# Altium project bms_mainboard-1_1.PrjPcb (part 8 of 8)

## Sheet pmic_bq25690_battcharger.SchDoc
size B
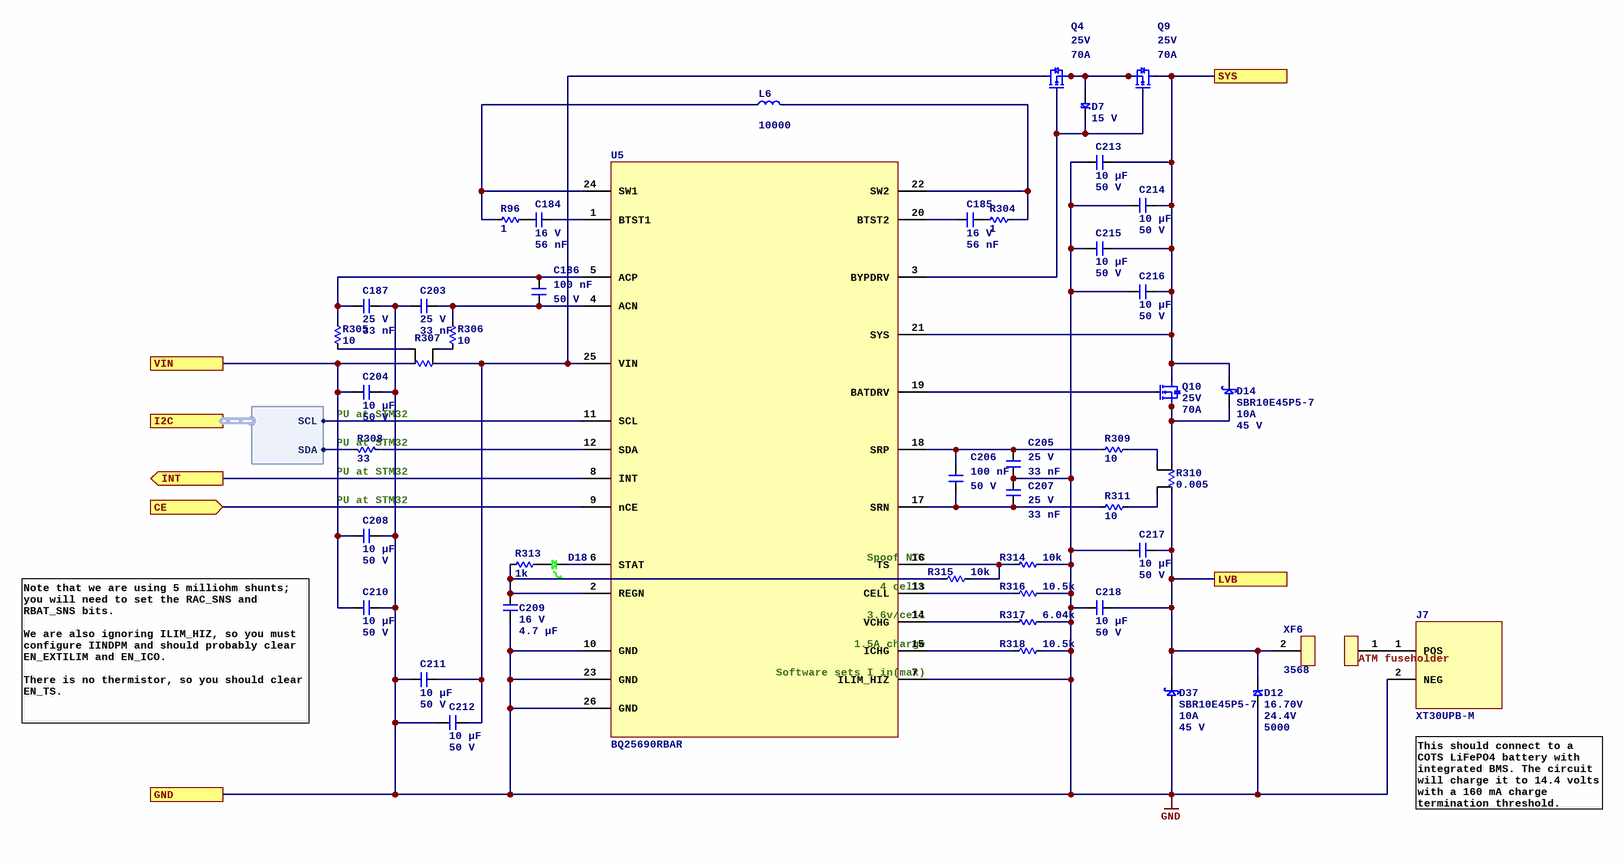
[diagram p46: pmic_bq25690_battcharger.SchDoc]

### Parts
C184  Voltage Rating: 16 V  Capacitance: 56 nF  [C0402]  (hidden comment: CC0402KRX7R7BB563)
C185  Voltage Rating: 16 V  Capacitance: 56 nF  [C0402]  (hidden comment: CC0402KRX7R7BB563)
C186  Capacitance: 100 nF  Voltage Rating: 50 V  [C0402]  (hidden comment: CL05B104KB54PNC)
C187  Voltage Rating: 25 V  Capacitance: 33 nF  [C0402]  (hidden comment: 0402B333K250NT)
C203  Voltage Rating: 25 V  Capacitance: 33 nF  [C0402]  (hidden comment: 0402B333K250NT)
C204  Capacitance: 10 µF  Voltage Rating: 50 V  [C1206]  (hidden comment: CL31B106KBHNNNE)
C205  Voltage Rating: 25 V  Capacitance: 33 nF  [C0402]  (hidden comment: 0402B333K250NT)
C206  Capacitance: 100 nF  Voltage Rating: 50 V  [C0402]  (hidden comment: CL05B104KB54PNC)
C207  Voltage Rating: 25 V  Capacitance: 33 nF  [C0402]  (hidden comment: 0402B333K250NT)
C208  Capacitance: 10 µF  Voltage Rating: 50 V  [C1206]  (hidden comment: CL31B106KBHNNNE)
C209  Voltage Rating: 16 V  Capacitance: 4.7 µF  [C0603]  (hidden comment: GRM188Z71C475KE21D)
C210  Capacitance: 10 µF  Voltage Rating: 50 V  [C1206]  (hidden comment: CL31B106KBHNNNE)
C211  Capacitance: 10 µF  Voltage Rating: 50 V  [C1206]  (hidden comment: CL31B106KBHNNNE)
C212  Capacitance: 10 µF  Voltage Rating: 50 V  [C1206]  (hidden comment: CL31B106KBHNNNE)
C213  Capacitance: 10 µF  Voltage Rating: 50 V  [C1206]  (hidden comment: CL31B106KBHNNNE)
C214  Capacitance: 10 µF  Voltage Rating: 50 V  [C1206]  (hidden comment: CL31B106KBHNNNE)
C215  Capacitance: 10 µF  Voltage Rating: 50 V  [C1206]  (hidden comment: CL31B106KBHNNNE)
C216  Capacitance: 10 µF  Voltage Rating: 50 V  [C1206]  (hidden comment: CL31B106KBHNNNE)
C217  Capacitance: 10 µF  Voltage Rating: 50 V  [C1206]  (hidden comment: CL31B106KBHNNNE)
C218  Capacitance: 10 µF  Voltage Rating: 50 V  [C1206]  (hidden comment: CL31B106KBHNNNE)
D7  Vr: 15 V  [SOD323]  (hidden comment: MM3Z15VC)
D12  Min Breakdown Voltage: 16.70V  Clamping Voltage-Max: 24.4V  Power (W): 5000  [SMC]  (hidden comment: 5.0SMDJ15A)
D14  SBR10E45P5-7  Current: 10A  Vr: 45 V  [POWERDI5]
D18  LTST-C190GKT  [LED_0603P_GREEN]  (value not drawn)
D37  SBR10E45P5-7  Current: 10A  Vr: 45 V  [POWERDI5]
J7  XT30UPB-M  [AMASS_XT30UPB-M]
L6  Current Rating (mA): 10000  [BOURNS_SRP1265A]  (hidden comment: SRP1265A-100M)
Q4  Voltage: 25V  Current: 70A  [SOT1210]  (hidden comment: PSMN2R0-25MLDX)
Q9  Voltage: 25V  Current: 70A  [SOT1210]  (hidden comment: PSMN2R0-25MLDX)
Q10  Voltage: 25V  Current: 70A  [SOT1210]  (hidden comment: PSMN2R0-25MLDX)
R96  value 1  [R0402]  (hidden comment: CRCW04021R00FKED)
R304  value 1  [R0402]  (hidden comment: CRCW04021R00FKED)
R305  value 10  [R0402]  (hidden comment: FRC0402F10R0TS)
R306  value 10  [R0402]  (hidden comment: FRC0402F10R0TS)
R307  WSL27265L000FEB  [VISHAY_WSL2726]  (value not drawn)
R308  value 33  [R0402]  (hidden comment: 0402WGF330JTCE)
R309  value 10  [R0402]  (hidden comment: FRC0402F10R0TS)
R310  value 0.005  [VISHAY_WSL2726]  (hidden comment: WSL27265L000FEB)
R311  value 10  [R0402]  (hidden comment: FRC0402F10R0TS)
R313  value 1k  [R0402]  (hidden comment: 0402WGF1001TCE)
R314  value 10k  [R0402]  (hidden comment: 0402WGF1002TCE)
R315  value 10k  [R0402]  (hidden comment: 0402WGF1002TCE)
R316  value 10.5k  [R0402]  (hidden comment: 0402WGF1052TCE)
R317  value 6.04k  [R0402]  (hidden comment: 0402WGF6041TCE)
R318  value 10.5k  [R0402]  (hidden comment: 0402WGF1052TCE)
U5  BQ25690RBAR  [TI_RBA]
XF6  3568  [FUSEHOLDER_KEYSTONE_3568]

### Ports
CE (in), GND, I2C (harness I2C), INT (out), LVB, SYS, VIN

### Harnesses
I2C: SCL, SDA

### Nets
15P0: C204.1 C208.1 C210.1 R307.2 ; port VIN
GND: C187.2 C203.1 C204.2 C205.1 C207.2 C208.2 C209.1 C210.2 C211.2 C212.2 C213.2 C214.2 C215.2 C216.2 C217.2 C218.2 D12.1 D37.1 J7.2(NEG) R314.1 R316.1 R317.1 R318.1 U5.7(ILIM_HIZ) U5.10(GND) U5.23(GND) U5.26(GND) ; port GND
LVB: C217.1 C218.1 D12.2 D37.2 R310.2 XF6.2 ; port LVB
SYS: C213.1 C214.1 C215.1 C216.1 D14.2 Q9.5 Q10.5 U5.21(SYS) ; port SYS
BQ25690_INT: U5.8(INT) ; port INT
BQ25690_nCE: U5.9(nCE) ; port CE
I2C1.SCL: U5.11(SCL) ; port I2C.SCL
I2C1.SDA: R308.1 ; port I2C.SDA
NetC184_1: C184.1 R96.2
NetC184_2: C184.2 U5.1(BTST1)
NetC185_1: C185.1 U5.20(BTST2)
NetC185_2: C185.2 R304.1
NetC186_1: C186.1 C187.1 R305.2 U5.5(ACP)
NetC186_2: C186.2 C203.2 R306.2 U5.4(ACN)
NetC205_2: C205.2 C206.1 R309.2 U5.18(SRP)
NetC206_2: C206.2 C207.1 R311.2 U5.17(SRN)
NetC209_2: C209.2 R313.1 R315.2 U5.2(REGN)
NetC211_1: C211.1 C212.1 Q4.5 R307.1 U5.25(VIN)
NetD7_1: D7.1 Q4.1 Q4.2 Q4.3 Q9.1 Q9.2 Q9.3
NetD7_2: D7.2 Q4.4 Q9.4 U5.3(BYPDRV)
NetD14_1: D14.1 Q10.1 Q10.2 Q10.3 R310.1
NetD18_1: D18.1 R313.2
NetD18_2: D18.2 U5.6(STAT)
NetJ7_1: J7.1(POS) XF6.1
NetL6_1: L6.1 R96.1 U5.24(SW1)
NetL6_2: L6.2 R304.2 U5.22(SW2)
NetQ10_4: Q10.4 U5.19(BATDRV)
NetR305_1: R305.1 R307.4
NetR306_1: R306.1 R307.3
NetR308_2: R308.2 U5.12(SDA)
NetR309_1: R309.1 R310.3
NetR310_4: R310.4 R311.1
NetR314_2: R314.2 R315.1 U5.16(TS)
NetR316_2: R316.2 U5.13(CELL)
NetR317_2: R317.2 U5.14(VCHG)
NetR318_2: R318.2 U5.15(ICHG)

### Notes on the sheet
- PU at STM32
- (near R308) PU at STM32
- (near R315) 4 cells
- (near R315) Spoof NTC
- 3.6v/cell
- 1.5A charge
- Software sets I_in(max)
- Note that we are using 5 milliohm shunts; you will need to set the RAC_SNS and RBAT_SNS bits.
  We are also ignoring ILIM_HIZ, so you must configure IINDPM and should probably clear EN_EXTILIM and EN_ICO.
  There is no thermistor, so you should clear EN_TS.
- This should connect to a COTS LiFePO4 battery with integrated BMS. The circuit will charge it to 14.4 volts with a 160 mA charge termination threshold.
- (in symbol 3568) ATM fuseholder

### Library data of the parts
C184 C185 = CC0402KRX7R7BB563: Manufacturer: YAGEO; Dielectric: X7R; Manufacturer Part Number: CC0402KRX7R7BB563; Package: 0402; Supplier 2: LCSC; Supplier Part Number 2: C107018; ComponentLink1Description: Datasheet; ComponentLink1URL: https://wmsc.lcsc.com/wmsc/upload/file/pdf/v2/lcsc/2304140030_YAGEO-CC0402KRX7R7BB563_C107018.pdf
C186 C206 = CL05B104KB54PNC: Manufacturer: Samsung Electro-Mechanics; Dielectric: X7R; ComponentLink1URL: https://wmsc.lcsc.com/wmsc/upload/file/pdf/v2/lcsc/2304140030_Samsung-Electro-Mechanics-CL05B104KB54PNC_C307331.pdf; ComponentLink1Description: Datasheet; Manufacturer Part Number: CL05B104KB54PNC; Package: 0402; Supplier 2: LCSC; Supplier Part Number 2: C307331
C187 C203 C205 C207 = 0402B333K250NT: Manufacturer: FH (Guangdong Fenghua Advanced Tech); Dielectric: X7R; Manufacturer Part Number: 0402B333K250NT; Package: 0402; Supplier 2: LCSC; Supplier Part Number 2: C285174; ComponentLink1Description: Datasheet; ComponentLink1URL: https://datasheet.lcsc.com/lcsc/2110191430_FH--Guangdong-Fenghua-Advanced-Tech-0402B333K250NT_C285174.pdf
C204 C208 C210-C218 = CL31B106KBHNNNE: Manufacturer: Samsung Electro-Mechanics; Dielectric: X7R; ComponentLink1URL: https://wmsc.lcsc.com/wmsc/upload/file/pdf/v2/lcsc/1810221111_Samsung-Electro-Mechanics-CL31B106KBHNNNE_C89632.pdf; ComponentLink1Description: Datasheet; Manufacturer Part Number: CL31B106KBHNNNE; Package: 1206; Supplier 2: LCSC; Supplier Part Number 2: C89632
C209 = GRM188Z71C475KE21D: Manufacturer: Murata Electronics; Dielectric: X7R; Manufacturer Part Number: GRM188Z71C475KE21D; Package: 0603; Supplier 2: LCSC; Supplier Part Number 2: C389010; ComponentLink1Description: Datasheet; ComponentLink1URL: https://wmsc.lcsc.com/wmsc/upload/file/pdf/v2/lcsc/1912111437_Murata-Electronics-GRM188Z71C475KE21D_C389010.pdf
D7 = MM3Z15VC: DIODE ZENER 15V 200MW SOD; Manufacturer: onsemi; Current: 13.3 mA; Supplier 1: DigiKey; Manufacturer Part Number: MM3Z15VC; ComponentLink1URL: https://www.onsemi.com/pdf/datasheet/mm3z9v1c-d.pdf; ComponentLink1Description: Datasheet; Supplier Part Number 1: MM3Z15VCCT-ND; Supplier 2: LCSC; Supplier Part Number 2: C891582; Diode Type: Zener; Supplier 3: Mouser; Supplier Part Number 3: 512-MM3Z15VC
D12 = 5.0SMDJ15A: TVS DIODE 15VWM 24.4VC DO214AB; Manufacturer: Bourns Inc.; Polarity: Unidirectional; Standoff (V): 15; ComponentLink1URL: https://www.bourns.com/docs/product-datasheets/5-0smdj.pdf; ComponentLink1Description: Datasheet; Supplier 1: DigiKey; Supplier Part Number 1: 5.0SMDJ15ABBCT-ND; Manufacturer Part Number: 5.0SMDJ15A; Supplier 2: LCSC; Supplier Part Number 2: C3707853; Supplier 3: Mouser; Supplier Part Number 3: 652-5.0SMDJ15A
D14 D37 = SBR10E45P5-7: Rectifier Diode, 1 Phase, 1 Element, 10A, 45V V(RRM), Silicon; Manufacturer: Diodes; Diode Type: Schottky; Supplier 1: DigiKey; Supplier Part Number 1: SBR10E45P5-7DICT-ND; Manufacturer Part Number: SBR10E45P5-7; ComponentLink1Description: Datasheet; ComponentLink1URL: https://www.diodes.com/assets/Datasheets/SBR10E45P5.pdf; Supplier 2: LCSC; Supplier Part Number 2: C73569; Supplier 3: Mouser; Supplier Part Number 3: 621-SBR10E45P5-7
D18 = LTST-C190GKT: LED GREEN CLEAR 0603 SMD; Manufacturer: Lite-On Inc; Vf: 2.0 V; If: 20 mA; Supplier 1: DigiKey; ComponentLink1URL: https://mm.digikey.com/Volume0/opasdata/d220001/medias/docus/858/LTST-C190GKT.pdf; ComponentLink1Description: Datasheet; Supplier Part Number 1: 160-1183-1-ND; Manufacturer Part Number: LTST-C190GKT; Supplier 2: LCSC; Supplier Part Number 2: C125093; LED Color: Green; Supplier 3: Mouser; Supplier Part Number 3: 859-LTST-C190GKT
J7 = XT30UPB-M: Vertical PCB mount XT30 male; Manufacturer: Changzhou Amass Elec; Manufacturer Part Number: XT30UPB-M; ComponentLink1Description: Datasheet; ComponentLink1URL: https://www.tme.com/Document/1191bc2fa3aee3c446e5a895fd8f7983/XT60PW-F.pdf; Supplier 2: LCSC; Supplier Part Number 2: C428721
L6 = SRP1265A-100M: 10 µH shielded power inductor; Manufacturer: BOURNS; DCR (mOhms): 16.5; Inductance (µH): 10; Manufacturer Part Number: SRP1265A-100M; Supplier 1: DigiKey; Supplier Part Number 1: SRP1265A-100MCT-ND; Supplier 2: LCSC; Supplier Part Number 2: C840531; ComponentLink1Description: Datasheet; ComponentLink1URL: https://www.bourns.com/docs/Product-Datasheets/SRP1265A.pdf; Supplier 3: Mouser; Supplier Part Number 3: 652-SRP1265A-100M
Q4 Q9 Q10 = PSMN2R0-25MLDX: N-Channel 25 V 70A (Tc) 74W (Tc) Surface Mount LFPAK33; Manufacturer: Nexperia; Supplier 1: DigiKey; Supplier Part Number 1: 1727-2501-1-ND; Manufacturer Part Number: PSMN2R0-25MLDX; Supplier 2: LCSC; Supplier Part Number 2: C553243; ComponentLink1Description: Datasheet; ComponentLink1URL: https://assets.nexperia.com/documents/data-sheet/PSMN2R0-25MLD.pdf; Channel Type: N-channel; Supplier 3: Mouser; Supplier Part Number 3: 771-PSMN2R0-25MLDX
R96 R304 = CRCW04021R00FKED: Manufacturer: Vishay Intertech; Power Rating (mW): 63; Tolerance: 1%; Temperature Coefficient: ±100ppm/?; Manufacturer Part Number: CRCW04021R00FKED; Package: 0402; Supplier 2: LCSC; Supplier Part Number 2: C482087; ComponentLink1Description: Datasheet; ComponentLink1URL: https://wmsc.lcsc.com/wmsc/upload/file/pdf/v2/lcsc/2211030200_Vishay-Intertech-CRCW04021R00FKED_C482087.pdf
R305 R306 R309 R311 = FRC0402F10R0TS: Manufacturer: FOJAN; Power Rating (mW): 62.5; Tolerance: 1%; Temperature Coefficient: ±100ppm/?; Manufacturer Part Number: FRC0402F10R0TS; Package: 0402; Supplier 2: LCSC; Supplier Part Number 2: C2906862; ComponentLink1Description: Datasheet; ComponentLink1URL: https://datasheet.lcsc.com/lcsc/2308241947_FOJAN-FRC0402F10R0TS_C2906862.pdf
R307 = WSL27265L000FEB: Manufacturer: Vishay Dale; Value: 0.005; Tolerance: 1%; Power Rating (mW): 3000; Supplier 1: DigiKey; Manufacturer Part Number: WSL27265L000FEB; ComponentLink1URL: http://www.vishay.com/docs/30131/wsl2726.pdf; ComponentLink1Description: Datasheet; Supplier Part Number 1: WSLQ-.005CT-ND; Supplier 2: LCSC; Supplier Part Number 2: C1517421; Package: 2726
R308 = 0402WGF330JTCE: as R149-R153 on sheet eth_10base-t1s_phy; ComponentLink1Description: Datasheet; ComponentLink1URL: https://wmsc.lcsc.com/wmsc/upload/file/pdf/v2/lcsc/2205311900_UNI-ROYAL-Uniroyal-Elec-0402WGF330JTCE_C25105.pdf; Manufacturer Part Number: 0402WGF330JTCE; Package: 0402; Supplier 2: LCSC; Supplier Part Number 2: C25105
R310 = WSL27265L000FEB: Manufacturer: Vishay Dale; Tolerance: 1%; Power Rating (mW): 3000; Supplier 1: DigiKey; Manufacturer Part Number: WSL27265L000FEB; ComponentLink1URL: http://www.vishay.com/docs/30131/wsl2726.pdf; ComponentLink1Description: Datasheet; Supplier Part Number 1: WSLQ-.005CT-ND; Supplier 2: LCSC; Supplier Part Number 2: C1517421; Package: 2726
R313 = 0402WGF1001TCE: Manufacturer: UNI-ROYAL(Uniroyal Elec); Tolerance: 1%; Temperature Coefficient: ±100ppm/?; Power Rating (mW): 62.5; ComponentLink1Description: Datasheet; ComponentLink1URL: https://wmsc.lcsc.com/wmsc/upload/file/pdf/v2/lcsc/2206010216_UNI-ROYAL-Uniroyal-Elec-0402WGF1001TCE_C11702.pdf; Manufacturer Part Number: 0402WGF1001TCE; Package: 0402; Supplier 2: LCSC; Supplier Part Number 2: C11702
R314 R315 = 0402WGF1002TCE: Manufacturer: UNI-ROYAL(Uniroyal Elec); Power Rating (mW): 62.5; Tolerance: 1%; Temperature Coefficient: ±100ppm/?; Manufacturer Part Number: 0402WGF1002TCE; Package: 0402; Supplier 2: LCSC; Supplier Part Number 2: C25744; ComponentLink1Description: Datasheet; ComponentLink1URL: https://wmsc.lcsc.com/wmsc/upload/file/pdf/v2/lcsc/2206010100_UNI-ROYAL-Uniroyal-Elec-0402WGF1002TCE_C25744.pdf
R316 R318 = 0402WGF1052TCE: Manufacturer: UNI-ROYAL(Uniroyal Elec); Power Rating (mW): 62.5; Tolerance: 1%; Temperature Coefficient: ±100ppm/?; Manufacturer Part Number: 0402WGF1052TCE; Package: 0402; Supplier 2: LCSC; Supplier Part Number 2: C25850; ComponentLink1Description: Datasheet; ComponentLink1URL: https://wmsc.lcsc.com/wmsc/upload/file/pdf/v2/lcsc/2206010045_UNI-ROYAL-Uniroyal-Elec-0402WGF1052TCE_C25850.pdf
R317 = 0402WGF6041TCE: Manufacturer: UNI-ROYAL(Uniroyal Elec); Power Rating (mW): 62.5; Tolerance: 1%; Temperature Coefficient: ±100ppm/?; Manufacturer Part Number: 0402WGF6041TCE; Package: 0402; Supplier 2: LCSC; Supplier Part Number 2: C25913; ComponentLink1Description: Datasheet; ComponentLink1URL: https://wmsc.lcsc.com/wmsc/upload/file/pdf/v2/lcsc/2206010045_UNI-ROYAL-Uniroyal-Elec-0402WGF6041TCE_C25913.pdf
U5 = BQ25690RBAR: Charger IC Lithium Ion/Polymer 26-WQFN-HR (4x3.5); Manufacturer: Texas Instruments; Supplier 1: DigiKey; Supplier Part Number 1: 296-BQ25690RBARCT-ND; Manufacturer Part Number: BQ25690RBAR; ComponentLink1Description: Datasheet; ComponentLink1URL: https://www.ti.com/lit/ds/symlink/bq25690.pdf; Supplier 2: LCSC; Supplier Part Number 2: C53283868; Supplier 3: Mouser; Supplier Part Number 3: 595-BQ25690RBAR
XF6 = 3568: Fuse Holder 30 A 500V 1 Circuit Blade Through Hole; Manufacturer: Keystone Electronics; Supplier 1: DigiKey; Supplier Part Number 1: 36-3568-ND; Manufacturer Part Number: 3568; ComponentLink1URL: https://www.keyelco.com/userAssets/file/M65p42.pdf; ComponentLink1Description: Datasheet; Supplier 2: LCSC; Supplier Part Number 2: C3206956; Supplier 3: Mouser; Supplier Part Number 3: 534-3568

## Sheet audio_tas5720_amplifier.SchDoc
size A
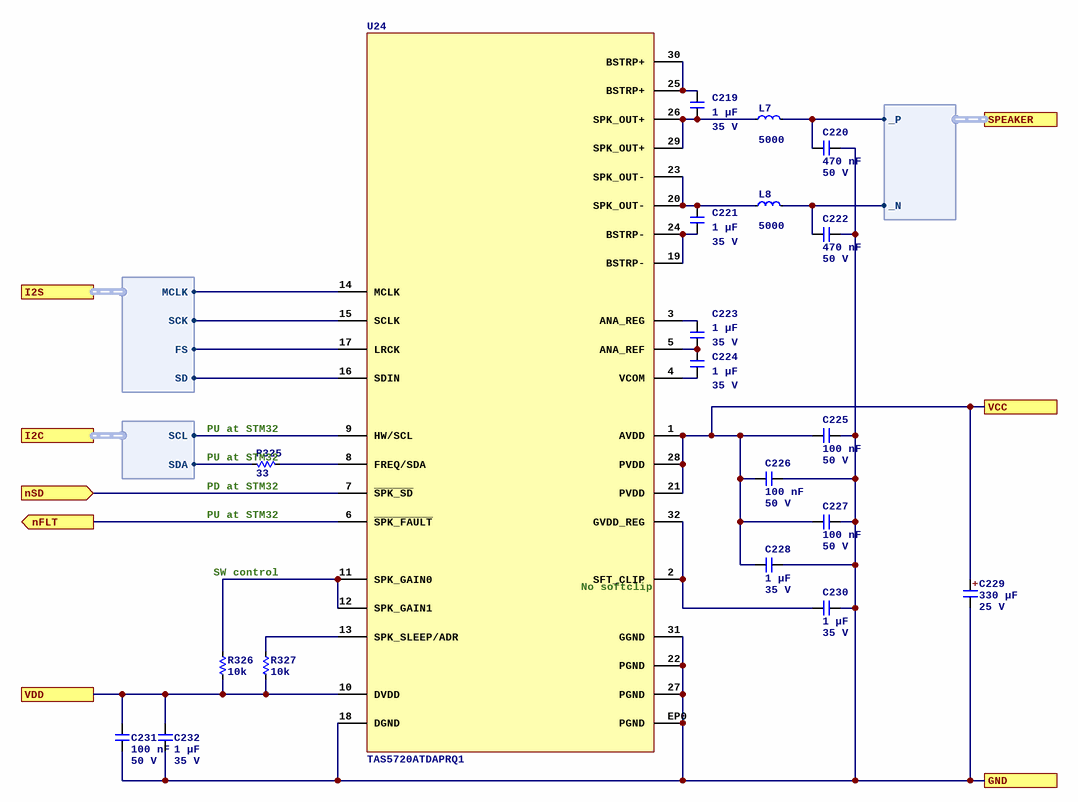
[diagram p47: audio_tas5720_amplifier.SchDoc]

### Parts
C219  Capacitance: 1 µF  Voltage Rating: 35 V  [C0603]  (hidden comment: GMK107AB7105KAHT)
C220  Capacitance: 470 nF  Voltage Rating: 50 V  [C0603]  (hidden comment: CC0603KRX7R9BB474)
C221  Capacitance: 1 µF  Voltage Rating: 35 V  [C0603]  (hidden comment: GMK107AB7105KAHT)
C222  Capacitance: 470 nF  Voltage Rating: 50 V  [C0603]  (hidden comment: CC0603KRX7R9BB474)
C223  Capacitance: 1 µF  Voltage Rating: 35 V  [C0603]  (hidden comment: GMK107AB7105KAHT)
C224  Capacitance: 1 µF  Voltage Rating: 35 V  [C0603]  (hidden comment: GMK107AB7105KAHT)
C225  Capacitance: 100 nF  Voltage Rating: 50 V  [C0402]  (hidden comment: CL05B104KB54PNC)
C226  Capacitance: 100 nF  Voltage Rating: 50 V  [C0402]  (hidden comment: CL05B104KB54PNC)
C227  Capacitance: 100 nF  Voltage Rating: 50 V  [C0402]  (hidden comment: CL05B104KB54PNC)
C228  Capacitance: 1 µF  Voltage Rating: 35 V  [C0603]  (hidden comment: GMK107AB7105KAHT)
C229  Capacitance: 330 µF  Voltage Rating: 25 V  [CAP_10001050_SMD]  (hidden comment: EEH-ZC1E331P)
C230  Capacitance: 1 µF  Voltage Rating: 35 V  [C0603]  (hidden comment: GMK107AB7105KAHT)
C231  Capacitance: 100 nF  Voltage Rating: 50 V  [C0402]  (hidden comment: CL05B104KB54PNC)
C232  Capacitance: 1 µF  Voltage Rating: 35 V  [C0603]  (hidden comment: GMK107AB7105KAHT)
L7  Current Rating (mA): 5000  [BOURNS_SRP5050FA]  (hidden comment: SRP5050FA-100M1)
L8  Current Rating (mA): 5000  [BOURNS_SRP5050FA]  (hidden comment: SRP5050FA-100M1)
R325  value 33  [R0402]  (hidden comment: 0402WGF330JTCE)
R326  value 10k  [R0402]  (hidden comment: 0402WGF1002TCE)
R327  value 10k  [R0402]  (hidden comment: 0402WGF1002TCE)
U24  TAS5720ATDAPRQ1  [TI_DAP0032B]

### Ports
GND, I2C (harness I2C), I2S (harness I2S), nFLT (out), nSD (in), SPEAKER (harness DIFF), VCC, VDD

### Harnesses
DIFF: _N, _P
I2S: MCLK, SCK, SD, FS
I2C: SCL, SDA

### Nets
3P3: C231.1 C232.1 R326.2 R327.2 U24.10(DVDD) ; port VDD
GND: C220.2 C222.2 C225.2 C226.2 C227.2 C228.2 C229.2 C230.2 C231.2 C232.2 U24.18(DGND) U24.22(PGND) U24.27(PGND) U24.31(GGND) U24.EP0(PGND) ; port GND
LV2: C225.1 C226.1 C227.1 C228.1 C229.1 U24.1(AVDD) U24.21(PVDD) U24.28(PVDD) ; port VCC
I2C1.SCL: U24.9(HW/SCL) ; port I2C.SCL
I2C1.SDA: R325.1 ; port I2C.SDA
SAI1_I2S.FS: U24.17(LRCK) ; port I2S.FS
SAI1_I2S.MCLK: U24.14(MCLK) ; port I2S.MCLK
SAI1_I2S.SCK: U24.15(SCLK) ; port I2S.SCK
SAI1_I2S.SD: U24.16(SDIN) ; port I2S.SD
SPEAKER._N: C222.1 L8.2 ; port SPEAKER._N
SPEAKER._P: C220.1 L7.2 ; port SPEAKER._P
SPK_nFLT: U24.6(~{SPK_FAULT}) ; port nFLT
SPK_nSD: U24.7(~{SPK_SD}) ; port nSD
NetC219_1: C219.1 U24.25(BSTRP+) U24.30(BSTRP+)
NetC219_2: C219.2 L7.1 U24.26(SPK_OUT+) U24.29(SPK_OUT+)
NetC221_1: C221.1 L8.1 U24.20(SPK_OUT-) U24.23(SPK_OUT-)
NetC221_2: C221.2 U24.19(BSTRP-) U24.24(BSTRP-)
NetC223_1: C223.1 U24.3(ANA_REG)
NetC223_2: C223.2 C224.1 U24.5(ANA_REF)
NetC224_2: C224.2 U24.4(VCOM)
NetC230_1: C230.1 U24.2(SFT_CLIP) U24.32(GVDD_REG)
NetR325_2: R325.2 U24.8(FREQ/SDA)
NetR326_1: R326.1 U24.11(SPK_GAIN0) U24.12(SPK_GAIN1)
NetR327_1: R327.1 U24.13(SPK_SLEEP/ADR)

### Notes on the sheet
- PU at STM32
- (near R325) PU at STM32
- PD at STM32
- (near U24) SW control
- (near U24) No softclip
- (in symbol EEH-ZC1E331P) +

### Library data of the parts
C219 C221 C223 C224 C228 C230 C232 = GMK107AB7105KAHT: Manufacturer: Taiyo Yuden; Dielectric: X7R; ComponentLink1URL: https://datasheet.lcsc.com/lcsc/2304140030_Taiyo-Yuden-GMK107AB7105KAHT_C841050.pdf; ComponentLink1Description: Datasheet; Manufacturer Part Number: GMK107AB7105KAHT; Package: 0603; Supplier 2: LCSC; Supplier Part Number 2: C841050
C220 C222 = CC0603KRX7R9BB474: Manufacturer: YAGEO; Dielectric: X7R; ComponentLink1URL: https://wmsc.lcsc.com/wmsc/upload/file/pdf/v2/lcsc/2409272232_YAGEO-CC0603KRX7R9BB474_C513577.pdf; ComponentLink1Description: Datasheet; Manufacturer Part Number: CC0603KRX7R9BB474; Package: 0603; Supplier 2: LCSC; Supplier Part Number 2: C513577
C225-C227 C231 = CL05B104KB54PNC: as C186 on sheet pmic_bq25690_battcharger; ComponentLink1URL: https://wmsc.lcsc.com/wmsc/upload/file/pdf/v2/lcsc/2304140030_Samsung-Electro-Mechanics-CL05B104KB54PNC_C307331.pdf; ComponentLink1Description: Datasheet; Manufacturer Part Number: CL05B104KB54PNC; Package: 0402; Supplier 2: LCSC; Supplier Part Number 2: C307331
C229 = EEH-ZC1E331P: SMD hybrid aluminum polymer capacitor, 330 µF, 25 V; Manufacturer: Panasonic Industry; Supplier 1: DigiKey; Supplier Part Number 1: P15459CT-ND; Manufacturer Part Number: EEH-ZC1E331P; Supplier 2: LCSC; Supplier Part Number 2: C178641; ComponentLink1Description: Datasheet; ComponentLink1URL: https://industrial.panasonic.com/cdbs/www-data/pdf/RDD0000/ABA0000C1234.pdf; Type: Aluminum Polymer; Supplier 3: Mouser; Supplier Part Number 3: 667-EEH-ZC1E331P
L7 L8 = SRP5050FA-100M1: 10 µH shielded power inductor; Manufacturer: BOURNS; DCR (mOhms): 43; Inductance (µH): 10; Manufacturer Part Number: SRP5050FA-100M1; Supplier 1: DigiKey; Supplier Part Number 1: 118-SRP5050FA-100M1CT-ND; Supplier 2: LCSC; Supplier Part Number 2: C3223883; ComponentLink1Description: Datasheet; ComponentLink1URL: https://www.bourns.com/docs/product-datasheets/srp5050fa.pdf; Supplier 3: Mouser; Supplier Part Number 3: 652-SRP5050FA-100M1
R325 = 0402WGF330JTCE: as R149-R153 on sheet eth_10base-t1s_phy; ComponentLink1Description: Datasheet; ComponentLink1URL: https://wmsc.lcsc.com/wmsc/upload/file/pdf/v2/lcsc/2205311900_UNI-ROYAL-Uniroyal-Elec-0402WGF330JTCE_C25105.pdf; Manufacturer Part Number: 0402WGF330JTCE; Package: 0402; Supplier 2: LCSC; Supplier Part Number 2: C25105
R326 R327 = 0402WGF1002TCE: as R314 on sheet pmic_bq25690_battcharger; Manufacturer Part Number: 0402WGF1002TCE; Package: 0402; Supplier 2: LCSC; Supplier Part Number 2: C25744; ComponentLink1Description: Datasheet; ComponentLink1URL: https://wmsc.lcsc.com/wmsc/upload/file/pdf/v2/lcsc/2206010100_UNI-ROYAL-Uniroyal-Elec-0402WGF1002TCE_C25744.pdf
U24 = TAS5720ATDAPRQ1: Amplifier IC 1-Channel (Mono) Class D 32-HTSSOP; Manufacturer: Texas Instruments; Supplier 1: DigiKey; Supplier Part Number 1: 296-51621-1-ND; Manufacturer Part Number: TAS5720ATDAPRQ1; Supplier Part Number 2: C2879310; ComponentLink1Description: Datasheet; ComponentLink1URL: https://www.ti.com/lit/ds/symlink/tas5720a-q1.pdf; Supplier 2: LCSC; Supplier 3: Mouser; Supplier Part Number 3: 595-TAS5720ATDAPRQ1

## Sheet eth_100base-tx_rtl8152b.SchDoc
size A
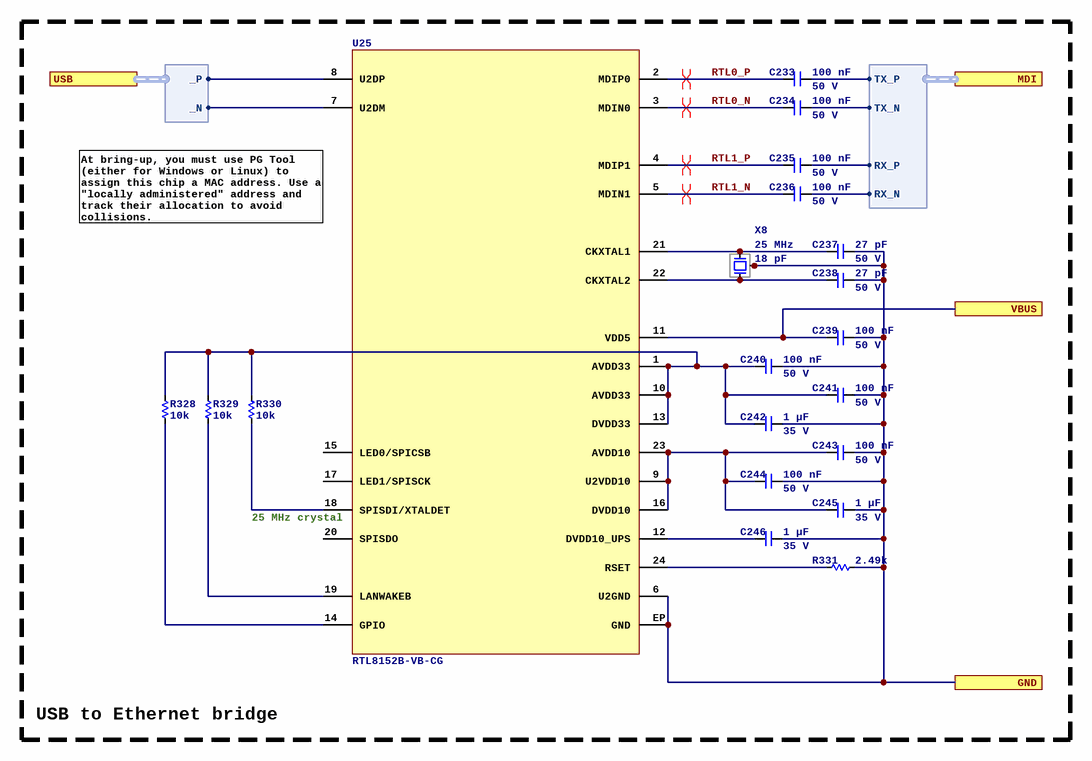
[diagram p48: eth_100base-tx_rtl8152b.SchDoc]

### Parts
C233  Capacitance: 100 nF  Voltage Rating: 50 V  [C0402]  (hidden comment: CL05B104KB54PNC)
C234  Capacitance: 100 nF  Voltage Rating: 50 V  [C0402]  (hidden comment: CL05B104KB54PNC)
C235  Capacitance: 100 nF  Voltage Rating: 50 V  [C0402]  (hidden comment: CL05B104KB54PNC)
C236  Capacitance: 100 nF  Voltage Rating: 50 V  [C0402]  (hidden comment: CL05B104KB54PNC)
C237  Capacitance: 27 pF  Voltage Rating: 50 V  [C0402]  (hidden comment: CC0402JRNPO9BN270)
C238  Capacitance: 27 pF  Voltage Rating: 50 V  [C0402]  (hidden comment: CC0402JRNPO9BN270)
C239  Capacitance: 100 nF  Voltage Rating: 50 V  [C0402]  (hidden comment: CL05B104KB54PNC)
C240  Capacitance: 100 nF  Voltage Rating: 50 V  [C0402]  (hidden comment: CL05B104KB54PNC)
C241  Capacitance: 100 nF  Voltage Rating: 50 V  [C0402]  (hidden comment: CL05B104KB54PNC)
C242  Capacitance: 1 µF  Voltage Rating: 35 V  [C0603]  (hidden comment: GMK107AB7105KAHT)
C243  Capacitance: 100 nF  Voltage Rating: 50 V  [C0402]  (hidden comment: CL05B104KB54PNC)
C244  Capacitance: 100 nF  Voltage Rating: 50 V  [C0402]  (hidden comment: CL05B104KB54PNC)
C245  Capacitance: 1 µF  Voltage Rating: 35 V  [C0603]  (hidden comment: GMK107AB7105KAHT)
C246  Capacitance: 1 µF  Voltage Rating: 35 V  [C0603]  (hidden comment: GMK107AB7105KAHT)
R328  value 10k  [R0402]  (hidden comment: 0402WGF1002TCE)
R329  value 10k  [R0402]  (hidden comment: 0402WGF1002TCE)
R330  value 10k  [R0402]  (hidden comment: 0402WGF1002TCE)
R331  value 2.49k  [R0402]  (hidden comment: 0402WGF2491TCE)
U25  RTL8152B-VB-CG  [24QFN4E]
X8  Frequency: 25 MHz  Capacitance: 18 pF  [4_SMD_3.2X2.5MM]  (hidden comment: ECS-250-18-33-JGN-TR3)

### Ports
GND, MDI (harness 100BASE-TX), USB (harness DIFF), VBUS

### Harnesses
DIFF: _N, _P
100BASE-TX: TX_N, TX_P, RX_N, RX_P

### Nets
GND: C237.2 C238.2 C239.1 C240.1 C241.1 C242.2 C243.1 C244.1 C245.2 C246.2 R331.1 U25.6(U2GND) U25.EP(GND) X8.2 X8.4 ; port GND
VBUS: C239.2 U25.11(VDD5) ; port VBUS
ETH_P5.RX_N: C236.1 ; port MDI.RX_N
ETH_P5.RX_P: C235.1 ; port MDI.RX_P
ETH_P5.TX_N: C234.1 ; port MDI.TX_N
ETH_P5.TX_P: C233.1 ; port MDI.TX_P
RTL0_N: C234.2 U25.3(MDIN0)
RTL0_P: C233.2 U25.2(MDIP0)
RTL1_N: C236.2 U25.5(MDIN1)
RTL1_P: C235.2 U25.4(MDIP1)
USB_DFP3._N: U25.7(U2DM) ; port USB._N
USB_DFP3._P: U25.8(U2DP) ; port USB._P
NetC237_1: C237.1 U25.21(CKXTAL1) X8.3
NetC238_1: C238.1 U25.22(CKXTAL2) X8.1
NetC240_2: C240.2 C241.2 C242.1 R328.1 R329.1 R330.1 U25.1(AVDD33) U25.10(AVDD33) U25.13(DVDD33)
NetC243_2: C243.2 C244.2 C245.1 U25.9(U2VDD10) U25.16(DVDD10) U25.23(AVDD10)
NetC246_1: C246.1 U25.12(DVDD10_UPS)
NetR328_2: R328.2 U25.14(GPIO)
NetR329_2: R329.2 U25.19(LANWAKEB)
NetR330_2: R330.2 U25.18(SPISDI/XTALDET)
NetR331_2: R331.2 U25.24(RSET)

Not connected (* = marked no-connect by the designer): U25 15(LED0/SPICSB) 17(LED1/SPISCK) 20(SPISDO)

### Layout directives
differential pair; differential pair class DE_100: RTL0_N, RTL0_P, RTL1_N, RTL1_P

### Notes on the sheet
- (near U25) At bring-up, you must use PG Tool (either for Windows or Linux) to assign this chip a MAC address. Use a "locally administered" address and track their allocation to avoid collisions.
- (near U25) 25 MHz crystal
- USB to Ethernet bridge

### Library data of the parts
C233-C236 C239-C241 C243 C244 = CL05B104KB54PNC: as C186 on sheet pmic_bq25690_battcharger; ComponentLink1URL: https://wmsc.lcsc.com/wmsc/upload/file/pdf/v2/lcsc/2304140030_Samsung-Electro-Mechanics-CL05B104KB54PNC_C307331.pdf; ComponentLink1Description: Datasheet; Manufacturer Part Number: CL05B104KB54PNC; Package: 0402; Supplier 2: LCSC; Supplier Part Number 2: C307331
C237 C238 = CC0402JRNPO9BN270: Manufacturer: YAGEO; Dielectric: NP0; ComponentLink1URL: https://wmsc.lcsc.com/wmsc/upload/file/pdf/v2/lcsc/2304140030_YAGEO-CC0402JRNPO9BN270_C107002.pdf; ComponentLink1Description: Datasheet; Manufacturer Part Number: CC0402JRNPO9BN270; Package: 0402; Supplier 2: LCSC; Supplier Part Number 2: C107002
C242 C245 C246 = GMK107AB7105KAHT: as C219 on sheet audio_tas5720_amplifier; ComponentLink1URL: https://datasheet.lcsc.com/lcsc/2304140030_Taiyo-Yuden-GMK107AB7105KAHT_C841050.pdf; ComponentLink1Description: Datasheet; Manufacturer Part Number: GMK107AB7105KAHT; Package: 0603; Supplier 2: LCSC; Supplier Part Number 2: C841050
R328-R330 = 0402WGF1002TCE: as R146-R148 on sheet eth_10base-t1s_phy; ComponentLink1Description: Datasheet; ComponentLink1URL: https://wmsc.lcsc.com/wmsc/upload/file/pdf/v2/lcsc/2206010100_UNI-ROYAL-Uniroyal-Elec-0402WGF1002TCE_C25744.pdf; Manufacturer Part Number: 0402WGF1002TCE; Package: 0402; Supplier 2: LCSC; Supplier Part Number 2: C25744
R331 = 0402WGF2491TCE: Manufacturer: UNI-ROYAL(Uniroyal Elec); Tolerance: 1%; Temperature Coefficient: ±100ppm/?; Power Rating (mW): 62.5; ComponentLink1Description: Datasheet; ComponentLink1URL: https://wmsc.lcsc.com/wmsc/upload/file/pdf/v2/lcsc/2206010045_UNI-ROYAL-Uniroyal-Elec-0402WGF2491TCE_C25884.pdf; Manufacturer Part Number: 0402WGF2491TCE; Package: 0402; Supplier 2: LCSC; Supplier Part Number 2: C25884
U25 = RTL8152B-VB-CG: Integrated 10/100M Ethernet Controller for USB Applications; Manufacturer: REALTEK; Manufacturer Part Number: RTL8152B-VB-CG; ComponentLink1Description: Datasheet; ComponentLink1URL: https://www1.futureelectronics.com/doc/Realtek/Realtek-Semicon-RTL8152B-VB-CG_C50656.pdf; Supplier 2: LCSC; Supplier Part Number 2: C50656
X8 = ECS-250-18-33-JGN-TR3: 25 MHz ±20ppm Crystal 18pF 40 Ohms 4-SMD, No Lead; Manufacturer: ECS Inc.; Supplier 1: DigiKey; Manufacturer Part Number: ECS-250-18-33-JGN-TR3; Supplier Part Number 1: 50-ECS-250-18-33-JGN-TR3CT-ND; Supplier 2: LCSC; Supplier Part Number 2: C5354421; ComponentLink1Description: Datasheet; ComponentLink1URL: https://ecsxtal.com/store/pdf/ecx-32.pdf; Supplier 3: Mouser; Supplier Part Number 3: 520-250-18-33JGN-TR3

## Nets that join several sheets
1P2: top (TP37.1), pmic_tps65263_buck (C31.1 C183.1 L3.2 R86.2), eth_ksz8567r_switch (17 pins)
3P3: top (TP35.1), bridge_bq79600 (C171.1 R288.2 R289.2 U22.3), mcu_stm32h5 (44 pins), ref_mcp1502_2p5 (C168.1 R252.1 U18.6), pmic_tps65263_buck (C28.1 L2.2 R71.2 U2.5), conn_sdcard (8 pins), fan0 (R115A.1), current_coil_hs (R136A.1), current_coil_ls (R136B.1), current_coil_pc (R136C.1), st-link-v2 (C72.1 U23.19 U23.20), conn_harness_lv/can1 (C102A.1 U10A.5), conn_harness_lv/can0 (C102B.1 U10B.5), eth_ksz8567r_switch (26 pins), conn_harness_lv/lv_switch0 (R219A.1), conn_harness_lv/lv_switch1 (R219B.1), conn_harness_lv/lv_switch2 (R219C.1), conn_harness_lv/sensor0 (D34A.2), conn_harness_lv/sensor1 (D34B.2), conn_harness_lv/digital0 (D43A.2 R264A.2 R265A.2), conn_harness_lv/digital1 (D43B.2 R264B.2 R265B.2), conn_harness_lv/digital2 (D43C.2 R264C.2 R265C.2), conn_harness_lv/digital3 (D43D.2 R264D.2 R265D.2), eth_10base-t1s_phy (8 pins), isolator_si8662 (C158.1 U14.1), imu_ism330 (FB16.1), dht_bme280 (C96.1 U9.2 U9.6 U9.8), fan1 (R115B.1), audio_tas5720_amplifier (5 pins)
3P3_B: adc_mcp3914 (8 pins), hv/hv_buffer0 (C74A.1 U26A.5), hv/hv_buffer1 (C74B.1 U26B.5), isolator_si8662 (C159.1 C162.1 U14.16 U16.5)
3P3_USB: top (TP90.1), usb_usb2534 (11 pins), st-link-v2 (14 pins), pmic_tps79933_usb (C198A.1 U20A.5)
5P0: top (TP33.1), bridge_bq79600 (5 pins), pmic_tps65263_buck (8 pins), conn_usbc (D16.2), conn_harness_lv/can1 (C101A.1 U10A.3), conn_harness_lv/can0 (C101B.1 U10B.3), conn_harness_lv/sensor0 (FB12A.1), conn_harness_lv/sensor1 (FB12B.1), isolator_si8662 (U15.2), pmic_tps79933_gnss (C197B.1 U20B.1 U20B.3), analog_lvb_sense (C56.1 Q8.2 U4.5)
15P0: pmic_cincon_brick (C59.2 C181.1 U6.3), pmic_bq25690_battcharger (C204.1 C208.1 C210.1 R307.2)
CHASSIS: top (9 pins), hv_architecture (K6.3 R295.2), pmic_cincon_brick (6 pins), conn_harness_lv (J12.11), eth_ksz8567r_switch (J8.SH), conn_harness_lv/ethernet_switch/mag0 (C49A.2), conn_harness_lv/ethernet_switch/mag1 (C49B.2), conn_harness_lv/ethernet_switch/mag2 (C49C.2)
GND: top (8 pins), coupling0 (C73A.2 C178A.2 C179A.2 D2A.3), bridge_bq79600 (9 pins), mcu_stm32h5 (71 pins), ref_mcp1502_2p5 (5 pins), pmic_tps65263_buck (29 pins), conn_sdcard (C176.2 J2.0 J2.6), hv_architecture (D9.2 K6.2), fan0 (C97A.2 C175A.2 J9A.1 Q5A.2), hv_bleed (D8.2 K4.2), current_coil_hs (12 pins), current_coil_ls (12 pins), current_coil_pc (12 pins), pmic_cincon_brick (5 pins), usb_usb2534 (15 pins), conn_usbc (7 pins), st-link-v2 (28 pins), conn_harness_lv (21 pins), conn_harness_lv/can1 (6 pins), conn_harness_lv/can0 (6 pins), eth_ksz8567r_switch (44 pins), conn_harness_lv/ethernet_switch/mag0 (C47A.2 C50A.2), conn_harness_lv/ethernet_switch/mag1 (C47B.2 C50B.2), conn_harness_lv/ethernet_switch/mag2 (C47C.2 C50C.2), conn_harness_lv/lv_switch0 (13 pins), conn_harness_lv/lv_switch1 (13 pins), conn_harness_lv/lv_switch2 (13 pins), conn_harness_lv/sensor0 (C148A.2 C149A.2 D34A.1 R218A.1), conn_harness_lv/sensor1 (C148B.2 C149B.2 D34B.1 R218B.1), conn_harness_lv/digital0 (C188A.2 D43A.1 Q11A.2), conn_harness_lv/digital1 (C188B.2 D43B.1 Q11B.2), conn_harness_lv/digital2 (C188C.2 D43C.1 Q11C.2), conn_harness_lv/digital3 (C188D.2 D43D.1 Q11D.2), eth_10base-t1s_phy (25 pins), isolator_si8662 (C158.2 U14.8 U15.1), pmic_tps79933_usb (C197A.2 C198A.2 C199A.2 U20A.2), imu_ism330 (7 pins), dht_bme280 (C96.2 U9.1 U9.5 U9.7), gnss_quectel_lc29hea (12 pins), pmic_tps79933_gnss (C197B.2 C198B.2 C199B.2 U20B.2), analog_lvb_sense (6 pins), coupling1 (C73B.2 C178B.2 C179B.2 D2B.3), fan1 (C97B.2 C175B.2 J9B.1 Q5B.2), pmic_bq25690_battcharger (27 pins), audio_tas5720_amplifier (15 pins), eth_100base-tx_rtl8152b (15 pins)
HV_N: adc_mcp3914 (10 pins), hv_architecture (12 pins), hv_bleed (K4.5), pmic_cincon_brick (R160.1), isolator_si8662 (8 pins)
HV_P: hv_architecture (F3.2 R338.1), hv_bleed (R112.2), pmic_cincon_brick (C58.1 C60.1 C99.1 U6.1)
LV1: top (TP34.1), current_coil_hs (C81A.2 C83A.2 U8A.2 U8A.11), current_coil_ls (C81B.2 C83B.2 U8B.2 U8B.11), current_coil_pc (C81C.2 C83C.2 U8C.2 U8C.11), conn_harness_lv/lv_switch1 (C157B.1 U13B.21 U13B.22)
LV2: top (TP36.1), fan0 (FB1A.1), conn_harness_lv/lv_switch1 (C156B.1 U13B.25 U13B.26), fan1 (FB1B.1), audio_tas5720_amplifier (8 pins)
LVB: top (TP32.1), analog_lvb_sense (D11.2 Q8.4 R100.1), pmic_bq25690_battcharger (6 pins)
SYS: top (TP5.1), pmic_tps65263_buck (D6.1), conn_harness_lv/lv_switch0 (C152A.1 U13A.EP), conn_harness_lv/lv_switch1 (C152B.1 U13B.EP), conn_harness_lv/lv_switch2 (C152C.1 U13C.EP), pmic_bq25690_battcharger (8 pins)
VBAT: top (BT1.1), mcu_stm32h5 (C7.1 U1.D3), gnss_quectel_lc29hea (D41.1)
VBUS: top (TP89.1), usb_usb2534 (R267.1), conn_usbc (C80.1 D16.1 J11.A4 J11.B4), st-link-v2 (R128.2 R201.1), pmic_tps79933_usb (C197A.1 U20A.1 U20A.3), eth_100base-tx_rtl8152b (C239.2 U25.11)
3P3_GNSS: gnss_quectel_lc29hea (C164.1 D40.1 U17.23), pmic_tps79933_gnss (C198B.1 U20B.5)
10B-T1S_MDI._N: conn_harness_lv (J13.22), eth_10base-t1s_phy (C88.2 R236.1 R238.1)
10B-T1S_MDI._P: conn_harness_lv (J13.21), eth_10base-t1s_phy (C89.2 R235.1 R237.1)
AIN0: mcu_stm32h5 (U1.M4), conn_harness_lv/sensor0 (C149A.1 D34A.3 R217A.1 R218A.2)
AIN1: mcu_stm32h5 (U1.R2), conn_harness_lv/sensor1 (C149B.1 D34B.3 R217B.1 R218B.2)
ARRAY_IS._N: adc_mcp3914/shunt3 (R107C.2), hv_architecture (R90.3)
ARRAY_IS._P: adc_mcp3914/shunt3 (R104C.2), hv_architecture (R90.4)
BATT_IS._N: adc_mcp3914/shunt2 (R107B.2), hv_architecture (R89.4)
BATT_IS._P: adc_mcp3914/shunt2 (R104B.2), hv_architecture (R89.3)
BQ25690_INT: mcu_stm32h5 (R4.2 U1.D10), pmic_bq25690_battcharger (U5.8)
BQ25690_nCE: mcu_stm32h5 (R5.1), pmic_bq25690_battcharger (U5.9)
CAN1_MDI._N: conn_harness_lv (J12.21), conn_harness_lv/can0 (T3B.3)
CAN1_MDI._P: conn_harness_lv (J12.22), conn_harness_lv/can0 (T3B.4)
CAN2_MDI._N: conn_harness_lv (J13.33), conn_harness_lv/can1 (T3A.3)
CAN2_MDI._P: conn_harness_lv (J13.34), conn_harness_lv/can1 (T3A.4)
CH0._N: adc_mcp3914 (U3.38), adc_mcp3914/shunt0 (C52A.2 C57A.2 R107A.1)
CH0._P: adc_mcp3914 (U3.37), adc_mcp3914/shunt0 (C52A.1 C54A.1 R104A.1)
CH2._N: adc_mcp3914 (TP72.1 U3.2), adc_mcp3914/shunt2 (C52B.2 C57B.2 R107B.1)
CH2._P: adc_mcp3914 (TP71.1 U3.1), adc_mcp3914/shunt2 (C52B.1 C54B.1 R104B.1)
CH3._N: adc_mcp3914 (U3.3), adc_mcp3914/shunt3 (C52C.2 C57C.2 R107C.1)
CH3._P: adc_mcp3914 (U3.4), adc_mcp3914/shunt3 (C52C.1 C54C.1 R104C.1)
CH4._N: adc_mcp3914 (U3.8), adc_mcp3914/shunt4 (C52D.2 C57D.2 R107D.1)
CH4._P: adc_mcp3914 (U3.7), adc_mcp3914/shunt4 (C52D.1 C54D.1 R104D.1)
CH5._N: adc_mcp3914 (U3.9), adc_mcp3914/shunt5 (C52E.2 C57E.2 R107E.1)
CH5._P: adc_mcp3914 (U3.10), adc_mcp3914/shunt5 (C52E.1 C54E.1 R104E.1)
COIL_HS._N: hv_architecture (K1.1), current_coil_hs (C84A.1 D21A.2 U8A.3)
COIL_HS._P: hv_architecture (K1.2), current_coil_hs (C82A.2 D20A.2 U8A.10)
COIL_LS._N: hv_architecture (K3.1), current_coil_ls (C84B.1 D21B.2 U8B.3)
COIL_LS._P: hv_architecture (K3.2), current_coil_ls (C82B.2 D20B.2 U8B.10)
COIL_PC._N: hv_architecture (K2.4), current_coil_pc (C84C.1 D21C.2 U8C.3)
COIL_PC._P: hv_architecture (K2.1), current_coil_pc (C82C.2 D20C.2 U8C.10)
DCDC_IS._N: adc_mcp3914/shunt0 (R107A.2), pmic_cincon_brick (R160.3)
DCDC_IS._P: adc_mcp3914/shunt0 (R104A.2), pmic_cincon_brick (R160.4)
DIN0: mcu_stm32h5 (U1.L15), conn_harness_lv/digital0 (Q11A.3 R264A.1)
DIN1: mcu_stm32h5 (U1.J12), conn_harness_lv/digital1 (Q11B.3 R264B.1)
DIN2: mcu_stm32h5 (U1.K14), conn_harness_lv/digital2 (Q11C.3 R264C.1)
DIN3: mcu_stm32h5 (U1.K15), conn_harness_lv/digital3 (Q11D.3 R264D.1)
EDISC_A: pmic_tps65263_buck (R59.1), conn_harness_lv (J12.7)
EDISC_B: pmic_tps65263_buck (R61.1), conn_harness_lv (J12.8)
ETH_P1.RX_N: conn_harness_lv (J13.28), conn_harness_lv/ethernet_switch/mag0 (T1A.16)
ETH_P1.RX_P: conn_harness_lv (J13.27), conn_harness_lv/ethernet_switch/mag0 (T1A.14)
ETH_P1.TX_N: conn_harness_lv (J13.26), conn_harness_lv/ethernet_switch/mag0 (T1A.11)
ETH_P1.TX_P: conn_harness_lv (J13.25), conn_harness_lv/ethernet_switch/mag0 (T1A.9)
ETH_P2.RX_N: conn_harness_lv (J12.28), conn_harness_lv/ethernet_switch/mag1 (T1B.16)
ETH_P2.RX_P: conn_harness_lv (J12.27), conn_harness_lv/ethernet_switch/mag1 (T1B.14)
ETH_P2.TX_N: conn_harness_lv (J12.26), conn_harness_lv/ethernet_switch/mag1 (T1B.11)
ETH_P2.TX_P: conn_harness_lv (J12.25), conn_harness_lv/ethernet_switch/mag1 (T1B.9)
ETH_P3.RX_N: conn_harness_lv (J12.34), conn_harness_lv/ethernet_switch/mag2 (T1C.16)
ETH_P3.RX_P: conn_harness_lv (J12.33), conn_harness_lv/ethernet_switch/mag2 (T1C.14)
ETH_P3.TX_N: conn_harness_lv (J12.32), conn_harness_lv/ethernet_switch/mag2 (T1C.11)
ETH_P3.TX_P: conn_harness_lv (J12.31), conn_harness_lv/ethernet_switch/mag2 (T1C.9)
ETH_P5.RX_N: eth_ksz8567r_switch (U11.116), eth_100base-tx_rtl8152b (C236.1)
ETH_P5.RX_P: eth_ksz8567r_switch (U11.115), eth_100base-tx_rtl8152b (C235.1)
ETH_P5.TX_N: eth_ksz8567r_switch (U11.113), eth_100base-tx_rtl8152b (C234.1)
ETH_P5.TX_P: eth_ksz8567r_switch (U11.112), eth_100base-tx_rtl8152b (C233.1)
ETH_REFCLK: mcu_stm32h5 (U1.L4), eth_ksz8567r_switch (R173.1)
ETH_SWITCH_nINT: mcu_stm32h5 (R332.1 U1.P5), eth_ksz8567r_switch (R286.2)
ETH_SWITCH_nRST: mcu_stm32h5 (R287.1), eth_ksz8567r_switch (C137.1 R188.2 U11.96)
ETH_SWITCH_nSS3: mcu_stm32h5 (R45.1), eth_ksz8567r_switch (U11.100)
ETH_SWITCH_SYNCLKO: mcu_stm32h5 (U1.P13), eth_ksz8567r_switch (R285.1)
FAN1_PWM: mcu_stm32h5 (R31.1), fan0 (R119A.2)
FAN1_TACH: mcu_stm32h5 (U1.L2), fan0 (D10A.1 R115A.2)
FAN2_PWM: mcu_stm32h5 (R34.1), fan1 (R119B.2)
FAN2_TACH: mcu_stm32h5 (U1.R9), fan1 (D10B.1 R115B.2)
FDCAN1.RX: mcu_stm32h5 (U1.C6), conn_harness_lv/can1 (U10A.4)
FDCAN1.TX: mcu_stm32h5 (R1.1), conn_harness_lv/can1 (R161A.1)
FDCAN2.RX: mcu_stm32h5 (U1.P15), conn_harness_lv/can0 (U10B.4)
FDCAN2.TX: mcu_stm32h5 (R33.1), conn_harness_lv/can0 (R161B.1)
GNSS_nRST: mcu_stm32h5 (R259.1), gnss_quectel_lc29hea (U17.8)
GNSS_WAKEUP: mcu_stm32h5 (R99.1), gnss_quectel_lc29hea (U17.1)
HIGHSIDE_CONTACTOR: mcu_stm32h5 (R15.1), current_coil_hs (R140A.2 R143A.1 U8A.15)
HV_DCDC_EN: mcu_stm32h5 (U1.M7), pmic_cincon_brick (R155.2 R156.1)
HV_nBLEED: mcu_stm32h5 (U1.N7), hv_bleed (R98.1 R132.2)
HV_VS._N: adc_mcp3914 (U3.39), hv_architecture (R88.1), hv/hv_buffer1 (C74B.2 U26B.2)
HV_VS._P: adc_mcp3914 (U3.40), hv/hv_buffer1 (U26B.3 U26B.4)
I2C1.SCL: mcu_stm32h5 (R36.1 R97.1), dht_bme280 (U9.4), pmic_bq25690_battcharger (U5.11), audio_tas5720_amplifier (U24.9)
I2C1.SDA: mcu_stm32h5 (R35.1 R54.1), dht_bme280 (R243.1), pmic_bq25690_battcharger (R308.1), audio_tas5720_amplifier (R325.1)
IMD_HIGH_SIDE_SWITCH_EN: mcu_stm32h5 (U1.R6), hv_architecture (R302.2 R303.1)
IMD_VS._N: adc_mcp3914 (U3.12), hv_architecture (R301.1), hv/hv_buffer0 (C74A.2 U26A.2)
IMD_VS._P: adc_mcp3914 (U3.11), hv/hv_buffer0 (U26A.3 U26A.4)
IMU_INT1: mcu_stm32h5 (U1.A14), imu_ism330 (R283.1)
IMU_INT2: mcu_stm32h5 (U1.B13), imu_ism330 (R284.2)
ISOUART_COMH._N: coupling0 (C179A.1 R292A.1 R293A.1), bridge_bq79600 (U22.12)
ISOUART_COMH._P: coupling0 (C178A.1 R291A.1 R292A.2), bridge_bq79600 (U22.13)
ISOUART_COML._N: bridge_bq79600 (U22.11), coupling1 (C179B.1 R292B.1 R293B.1)
ISOUART_COML._P: bridge_bq79600 (U22.10), coupling1 (C178B.1 R291B.1 R292B.2)
LOWSIDE_CONTACTOR: mcu_stm32h5 (R16.1), current_coil_ls (R140B.2 R143B.1 U8B.15)
LV_nSS0: mcu_stm32h5 (R260.1), conn_harness_lv/lv_switch0 (R224A.2)
LV_nSS1: mcu_stm32h5 (R262.1), conn_harness_lv/lv_switch1 (R224B.2)
LV_nSS2: mcu_stm32h5 (R261.1), conn_harness_lv/lv_switch2 (R224C.2)
LV_PWM_CLK: mcu_stm32h5 (R11.1), conn_harness_lv/lv_switch0 (R223A.2), conn_harness_lv/lv_switch1 (R223B.2), conn_harness_lv/lv_switch2 (R223C.2)
LVB_DIV: mcu_stm32h5 (U1.M2), analog_lvb_sense (C71.1 R105.2)
MC0_IS._N: adc_mcp3914/shunt4 (R107D.2), hv_architecture (R80.4)
MC0_IS._P: adc_mcp3914/shunt4 (R104D.2), hv_architecture (R80.3)
MC1_IS._N: adc_mcp3914/shunt5 (R107E.2), hv_architecture (R83.3)
MC1_IS._P: adc_mcp3914/shunt5 (R104E.2), hv_architecture (R83.4)
MCP3914B_nDR: mcu_stm32h5 (U1.R11), isolator_si8662 (R233.2)
MCP3914B_nDR_ISO: adc_mcp3914 (R75.1 U3.22), isolator_si8662 (U14.11)
MCP3914B_nRST: mcu_stm32h5 (R28.1), isolator_si8662 (U14.5)
MCP3914B_nRST_ISO: adc_mcp3914 (C34.1 R76.1 U3.31), isolator_si8662 (R228.1)
MCU_nRST: mcu_stm32h5 (C14.1 R30.2 R32.1 U1.J5), st-link-v2 (U23.15)
MCU_RMII.CRS_DV: mcu_stm32h5 (U1.P3), eth_ksz8567r_switch (R174.1)
MCU_RMII.RXD0: mcu_stm32h5 (U1.N4), eth_ksz8567r_switch (R175.1 R176.2)
MCU_RMII.RXD1: mcu_stm32h5 (U1.M5), eth_ksz8567r_switch (R178.1)
MCU_RMII.TX_EN: mcu_stm32h5 (R38.1), eth_ksz8567r_switch (U11.49)
MCU_RMII.TXD0: mcu_stm32h5 (R40.1), eth_ksz8567r_switch (U11.55)
MCU_RMII.TXD1: mcu_stm32h5 (R41.1), eth_ksz8567r_switch (U11.54)
MII_P7.COL: eth_ksz8567r_switch (U11.69), eth_10base-t1s_phy (R192.2)
MII_P7.CRS: eth_ksz8567r_switch (U11.79), eth_10base-t1s_phy (R191.2 R239.1)
MII_P7.RX_CLK: eth_ksz8567r_switch (U11.66), eth_10base-t1s_phy (R150.2)
MII_P7.RX_DV: eth_ksz8567r_switch (U11.67), eth_10base-t1s_phy (R149.2 R187.1)
MII_P7.RX_ER: eth_ksz8567r_switch (U11.68), eth_10base-t1s_phy (R172.2 R177.1)
MII_P7.RXD0: eth_ksz8567r_switch (U11.73), eth_10base-t1s_phy (R151.2 R185.1)
MII_P7.RXD1: eth_ksz8567r_switch (U11.72), eth_10base-t1s_phy (R153.2 R184.1)
MII_P7.RXD2: eth_ksz8567r_switch (U11.71), eth_10base-t1s_phy (R146.2 R157.2)
MII_P7.RXD3: eth_ksz8567r_switch (U11.70), eth_10base-t1s_phy (R158.2 R183.1)
MII_P7.TX_CLK: eth_ksz8567r_switch (U11.75), eth_10base-t1s_phy (R190.2)
MII_P7.TX_EN: eth_ksz8567r_switch (R103.1), eth_10base-t1s_phy (R333.1 U7.7)
MII_P7.TX_ER: eth_ksz8567r_switch (R120.1), eth_10base-t1s_phy (U7.11)
MII_P7.TXD0: eth_ksz8567r_switch (R121.1 R122.2), eth_10base-t1s_phy (U7.6)
MII_P7.TXD1: eth_ksz8567r_switch (R123.1 R124.2), eth_10base-t1s_phy (U7.5)
MII_P7.TXD2: eth_ksz8567r_switch (R125.1 R130.2), eth_10base-t1s_phy (U7.4)
MII_P7.TXD3: eth_ksz8567r_switch (R131.1 R133.2), eth_10base-t1s_phy (U7.3)
NetC37_2: adc_mcp3914 (8 pins), adc_mcp3914/shunt0 (C54A.2 C57A.1), adc_mcp3914/shunt2 (C54B.2 C57B.1), adc_mcp3914/shunt3 (C54C.2 C57C.1), adc_mcp3914/shunt4 (C54D.2 C57D.1), adc_mcp3914/shunt5 (C54E.2 C57E.1)
NetC53_1: hv_architecture (C53.1 R85.2 R87.1), hv/hv_buffer1 (U26B.1)
NetC148A_1: conn_harness_lv (J12.3), conn_harness_lv/sensor0 (C148A.1 FB12A.2)
NetC148B_1: conn_harness_lv (J12.6), conn_harness_lv/sensor1 (C148B.1 FB12B.2)
NetC150A_1: conn_harness_lv (J12.13), conn_harness_lv/lv_switch0 (C150A.1 U13A.3 U13A.4)
NetC150B_1: conn_harness_lv (J13.16), conn_harness_lv/lv_switch1 (C150B.1 U13B.3 U13B.4)
NetC150C_1: conn_harness_lv (J13.35), conn_harness_lv/lv_switch2 (C150C.1 U13C.3 U13C.4)
NetC151A_1: conn_harness_lv (J12.24), conn_harness_lv/lv_switch0 (C151A.1 U13A.31 U13A.32)
NetC151B_1: conn_harness_lv (J13.3), conn_harness_lv/lv_switch1 (C151B.1 U13B.31 U13B.32)
NetC151C_1: conn_harness_lv (J13.30), conn_harness_lv/lv_switch2 (C151C.1 U13C.31 U13C.32)
NetC154A_1: conn_harness_lv (J12.15), conn_harness_lv/lv_switch0 (C154A.1 U13A.29 U13A.30)
NetC154B_1: conn_harness_lv (J13.1), conn_harness_lv/lv_switch1 (C154B.1 U13B.29 U13B.30)
NetC154C_1: conn_harness_lv (J13.19), conn_harness_lv/lv_switch2 (C154C.1 U13C.29 U13C.30)
NetC155A_1: conn_harness_lv (J12.17), conn_harness_lv/lv_switch0 (C155A.1 U13A.27 U13A.28)
NetC155B_1: conn_harness_lv (J13.24), conn_harness_lv/lv_switch1 (C155B.1 U13B.27 U13B.28)
NetC155C_1: conn_harness_lv (J13.7), conn_harness_lv/lv_switch2 (C155C.1 U13C.27 U13C.28)
NetC156A_1: conn_harness_lv (J12.23), conn_harness_lv/lv_switch0 (C156A.1 U13A.25 U13A.26)
NetC156C_1: conn_harness_lv (J13.18), conn_harness_lv/lv_switch2 (C156C.1 U13C.25 U13C.26)
NetC157A_1: conn_harness_lv (J12.35), conn_harness_lv/lv_switch0 (C157A.1 U13A.21 U13A.22)
NetC157C_1: conn_harness_lv (J13.5), conn_harness_lv/lv_switch2 (C157C.1 U13C.21 U13C.22)
NetC177_1: mcu_stm32h5 (C177.1 C180.1 U1.K5), ref_mcp1502_2p5 (R251.2)
NetJ12_2: conn_harness_lv (J12.2), conn_harness_lv/sensor0 (R217A.2)
NetJ12_5: conn_harness_lv (J12.5), conn_harness_lv/sensor1 (R217B.2)
NetJ12_9: conn_harness_lv (J12.9), conn_harness_lv/digital1 (R266B.1)
NetJ12_19: conn_harness_lv (J12.19), conn_harness_lv/digital0 (R266A.1)
NetJ13_13: conn_harness_lv (J13.13), conn_harness_lv/digital2 (R266C.1)
NetJ13_15: conn_harness_lv (J13.15), conn_harness_lv/digital3 (R266D.1)
NetR298_1: hv_architecture (R298.1 R299.2 R300.2), hv/hv_buffer0 (U26A.1)
P1_MDI_PHY.RX_N: eth_ksz8567r_switch (U11.5), conn_harness_lv/ethernet_switch/mag0 (T1A.1)
P1_MDI_PHY.RX_P: eth_ksz8567r_switch (U11.4), conn_harness_lv/ethernet_switch/mag0 (T1A.3)
P1_MDI_PHY.TX_N: eth_ksz8567r_switch (U11.2), conn_harness_lv/ethernet_switch/mag0 (T1A.6)
P1_MDI_PHY.TX_P: eth_ksz8567r_switch (U11.1), conn_harness_lv/ethernet_switch/mag0 (T1A.8)
P2_MDI_PHY.RX_N: eth_ksz8567r_switch (U11.16), conn_harness_lv/ethernet_switch/mag1 (T1B.1)
P2_MDI_PHY.RX_P: eth_ksz8567r_switch (U11.15), conn_harness_lv/ethernet_switch/mag1 (T1B.3)
P2_MDI_PHY.TX_N: eth_ksz8567r_switch (U11.13), conn_harness_lv/ethernet_switch/mag1 (T1B.6)
P2_MDI_PHY.TX_P: eth_ksz8567r_switch (U11.12), conn_harness_lv/ethernet_switch/mag1 (T1B.8)
P3_MDI_PHY.RX_N: eth_ksz8567r_switch (U11.27), conn_harness_lv/ethernet_switch/mag2 (T1C.1)
P3_MDI_PHY.RX_P: eth_ksz8567r_switch (U11.26), conn_harness_lv/ethernet_switch/mag2 (T1C.3)
P3_MDI_PHY.TX_N: eth_ksz8567r_switch (U11.25), conn_harness_lv/ethernet_switch/mag2 (T1C.6)
P3_MDI_PHY.TX_P: eth_ksz8567r_switch (U11.24), conn_harness_lv/ethernet_switch/mag2 (T1C.8)
PHY_GPIO0: mcu_stm32h5 (R53.1), eth_10base-t1s_phy (R152.2)
PHY_nIRQ: mcu_stm32h5 (U1.C2), eth_10base-t1s_phy (R147.2 U7.22)
PHY_nRESET: mcu_stm32h5 (R46.1), eth_10base-t1s_phy (C77.1 R148.2 U7.10)
PMIC_EN_DETECT: mcu_stm32h5 (U1.D5), pmic_tps65263_buck (R63.1)
PMIC_FORCE_EN: mcu_stm32h5 (R6.1), pmic_tps65263_buck (D3.1)
PRECHARGE_CONTACTOR: mcu_stm32h5 (R17.1), current_coil_pc (R140C.2 R143C.1 U8C.15)
SAI1_I2S.FS: mcu_stm32h5 (R319.1), audio_tas5720_amplifier (U24.17)
SAI1_I2S.MCLK: mcu_stm32h5 (R324.1), audio_tas5720_amplifier (U24.14)
SAI1_I2S.SCK: mcu_stm32h5 (R320.1), audio_tas5720_amplifier (U24.15)
SAI1_I2S.SD: mcu_stm32h5 (R321.1), audio_tas5720_amplifier (U24.16)
SD_DETECT: mcu_stm32h5 (U1.C11), conn_sdcard (J2.9 R129.1)
SDIO.CLK: mcu_stm32h5 (R51.1), conn_sdcard (J2.5)
SDIO.CMD: mcu_stm32h5 (R2.1), conn_sdcard (J2.3 R117.1)
SDIO.D0: mcu_stm32h5 (R47.1), conn_sdcard (J2.7 R114.1)
SDIO.D1: mcu_stm32h5 (R48.1), conn_sdcard (J2.8 R118.1)
SDIO.D2: mcu_stm32h5 (R49.1), conn_sdcard (J2.1 R116.1)
SDIO.D3: mcu_stm32h5 (R50.1), conn_sdcard (J2.2 R113.1)
SMI.MDC: mcu_stm32h5 (R95.1), eth_10base-t1s_phy (U7.13)
SMI.MDIO: mcu_stm32h5 (R52.1 U1.M3), eth_10base-t1s_phy (R159.2)
SPEAKER._N: conn_harness_lv (J13.12), audio_tas5720_amplifier (C222.1 L8.2)
SPEAKER._P: conn_harness_lv (J13.11), audio_tas5720_amplifier (C220.1 L7.2)
SPI2.MISO: mcu_stm32h5 (U1.F10), eth_ksz8567r_switch (R134.2), conn_harness_lv/lv_switch0 (D36A.2 R227A.1), conn_harness_lv/lv_switch1 (D36B.2 R227B.1), conn_harness_lv/lv_switch2 (D36C.2 R227C.1)
SPI2.MOSI: mcu_stm32h5 (R44.1), eth_ksz8567r_switch (U11.98), conn_harness_lv/lv_switch0 (R226A.2), conn_harness_lv/lv_switch1 (R226B.2), conn_harness_lv/lv_switch2 (R226C.2)
SPI2.SCK: mcu_stm32h5 (R3.1), eth_ksz8567r_switch (U11.101), conn_harness_lv/lv_switch0 (R225A.2), conn_harness_lv/lv_switch1 (R225B.2), conn_harness_lv/lv_switch2 (R225C.2)
SPI4.MISO: mcu_stm32h5 (U1.P10), isolator_si8662 (R232.2)
SPI4.MOSI: mcu_stm32h5 (R43.1), isolator_si8662 (U14.4)
SPI4.SCK: mcu_stm32h5 (R25.1), isolator_si8662 (U14.3)
SPI4_ISO.MISO: adc_mcp3914 (R74.2), isolator_si8662 (U14.10)
SPI4_ISO.MOSI: adc_mcp3914 (U3.30), isolator_si8662 (R231.1)
SPI4_ISO.SCK: adc_mcp3914 (U3.28), isolator_si8662 (R230.1)
SPI4_nSS: mcu_stm32h5 (R29.1), isolator_si8662 (U14.2)
SPI4_nSS_ISO: adc_mcp3914 (U3.27), isolator_si8662 (R229.1)
SPI6.MISO: mcu_stm32h5 (U1.C8), imu_ism330 (R282.1)
SPI6.MOSI: mcu_stm32h5 (R23.1), imu_ism330 (U21.14)
SPI6.SCK: mcu_stm32h5 (R19.1), imu_ism330 (U21.13)
SPI6_nSS: mcu_stm32h5 (R18.1), imu_ism330 (U21.12)
SPK_nFLT: mcu_stm32h5 (R323.2 U1.E2), audio_tas5720_amplifier (U24.6)
SPK_nSD: mcu_stm32h5 (R322.2 U1.E4), audio_tas5720_amplifier (U24.7)
SW0_DI0: mcu_stm32h5 (U1.R5), conn_harness_lv/lv_switch0 (R221A.2 R334A.1)
SW0_DI1: mcu_stm32h5 (U1.N6), conn_harness_lv/lv_switch0 (R222A.2 R335A.1)
SW1_DI0: mcu_stm32h5 (U1.P8), conn_harness_lv/lv_switch1 (R221B.2 R334B.1)
SW1_DI1: mcu_stm32h5 (U1.R8), conn_harness_lv/lv_switch1 (R222B.2 R335B.1)
SW2_DI0: mcu_stm32h5 (U1.P9), conn_harness_lv/lv_switch2 (R221C.2 R334C.1)
SW2_DI1: mcu_stm32h5 (U1.N9), conn_harness_lv/lv_switch2 (R222C.2 R335C.1)
SWD.SWCLK: mcu_stm32h5 (R26.1 U1.C15), st-link-v2 (U23.14)
SWD.SWDIO: mcu_stm32h5 (R22.1 U1.F12), st-link-v2 (U23.13)
SWD.SWO: mcu_stm32h5 (R56.1 U1.B7), st-link-v2 (U23.18)
TIMEPULSE: top (TP4.1), mcu_stm32h5 (R337.2 U1.N11), eth_ksz8567r_switch (U11.90), gnss_quectel_lc29hea (R247.2)
UART7.RX: mcu_stm32h5 (U1.L8), st-link-v2 (U23.16)
UART7.TX: mcu_stm32h5 (R37.1), st-link-v2 (U23.17)
UART8.RX: mcu_stm32h5 (U1.D6), gnss_quectel_lc29hea (R244.2)
UART8.TX: mcu_stm32h5 (R21.1), gnss_quectel_lc29hea (D39.2)
USART2.RX: bridge_bq79600 (R290.2), mcu_stm32h5 (U1.A10)
USART2.TX: bridge_bq79600 (R288.1 U22.4), mcu_stm32h5 (R294.1)
USB_DFP1._N: mcu_stm32h5 (U1.F15), usb_usb2534 (U19.1)
USB_DFP1._P: mcu_stm32h5 (U1.F14), usb_usb2534 (U19.2)
USB_DFP2._N: usb_usb2534 (U19.3), st-link-v2 (U12.32)
USB_DFP2._P: usb_usb2534 (U19.4), st-link-v2 (R204.2 U12.33)
USB_DFP3._N: usb_usb2534 (U19.6), eth_100base-tx_rtl8152b (U25.7)
USB_DFP3._P: usb_usb2534 (U19.7), eth_100base-tx_rtl8152b (U25.8)
USB_UFP._N: usb_usb2534 (U19.30), conn_usbc (D17.1 J11.A7 J11.B7)
USB_UFP._P: usb_usb2534 (U19.31), conn_usbc (D17.2 J11.A6 J11.B6)

## Assembly variants
0: not fitted R216